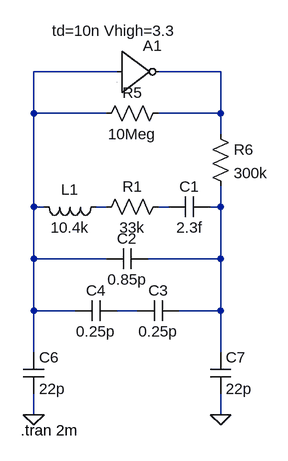
[diagram p0: schematic xtal_osc.asc]
xtal_osc.asc, the LTspice schematic file:
Version 4
SHEET 1 916 712
WIRE -576 144 -704 144
WIRE -416 144 -512 144
WIRE -704 208 -704 144
WIRE -592 208 -704 208
WIRE -416 208 -416 144
WIRE -416 208 -512 208
WIRE -416 240 -416 208
WIRE -704 352 -704 208
WIRE -688 352 -704 352
WIRE -592 352 -608 352
WIRE -496 352 -512 352
WIRE -416 352 -416 320
WIRE -416 352 -432 352
WIRE -704 432 -704 352
WIRE -592 432 -704 432
WIRE -416 432 -416 352
WIRE -416 432 -528 432
WIRE -704 512 -704 432
WIRE -640 512 -704 512
WIRE -544 512 -576 512
WIRE -416 512 -416 432
WIRE -416 512 -480 512
WIRE -704 576 -704 512
WIRE -416 576 -416 512
WIRE -704 672 -704 640
WIRE -416 672 -416 640
FLAG -704 672 0
FLAG -416 672 0
SYMBOL cap -432 336 R90
WINDOW 0 0 32 VBottom 2
WINDOW 3 32 32 VTop 2
SYMATTR InstName C1
SYMATTR Value 2.3f
SYMBOL cap -528 416 R90
WINDOW 0 0 32 VBottom 2
WINDOW 3 32 32 VTop 2
SYMATTR InstName C2
SYMATTR Value 0.85p
SYMBOL cap -480 496 R90
WINDOW 0 0 32 VBottom 2
WINDOW 3 32 32 VTop 2
SYMATTR InstName C3
SYMATTR Value 0.25p
SYMBOL cap -576 496 R90
WINDOW 0 0 32 VBottom 2
WINDOW 3 32 32 VTop 2
SYMATTR InstName C4
SYMATTR Value 0.25p
SYMBOL res -496 336 R90
WINDOW 0 0 56 VBottom 2
WINDOW 3 32 56 VTop 2
SYMATTR InstName R1
SYMATTR Value 33k
SYMBOL ind -592 336 R90
WINDOW 0 5 56 VBottom 2
WINDOW 3 32 56 VTop 2
SYMATTR InstName L1
SYMATTR Value 10.4k
SYMBOL Digital\\inv -576 80 R0
WINDOW 3 -100 1 Left 2
SYMATTR InstName A1
SYMATTR Value td=10n Vhigh=3.3
SYMBOL res -496 192 R90
WINDOW 0 0 56 VBottom 2
WINDOW 3 32 56 VTop 2
SYMATTR InstName R5
SYMATTR Value 10Meg
SYMBOL res -432 224 R0
SYMATTR InstName R6
SYMATTR Value 300k
SYMBOL cap -720 576 R0
SYMATTR InstName C6
SYMATTR Value 22p
SYMBOL cap -432 576 R0
SYMATTR InstName C7
SYMATTR Value 22p
TEXT -724 696 Left 2 !.tran 2m

The netlist it stands for:
* xtal_osc.asc
C1 N005 N004 2.3f
C2 N005 N001 0.85p
C3 N005 N006 0.25p
C4 N006 N001 0.25p
R1 N004 N003 33k
L1 N003 N001 10.4k
A1 N001 0 0 0 0 N002 0 0 BUF td=10n Vhigh=3.3
R5 N002 N001 10Meg
R6 N002 N005 300k
C6 N001 0 22p
C7 N005 0 22p
.tran 2m
.backanno
.end